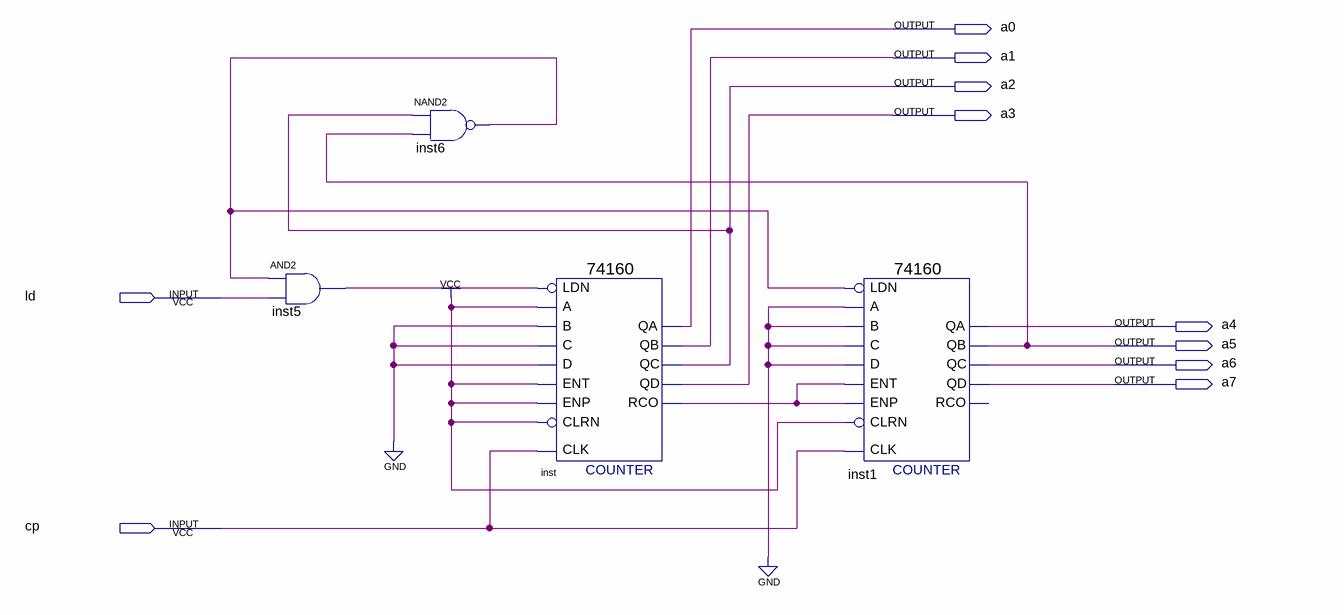
[diagram p0: schematic sheet]
// Quartus schematic jz24.bdf as structural Verilog: 4 symbols, 10 pins
module jz24 (
  input  ld,
  input  cp,
  output a0,
  output a1,
  output a2,
  output a3,
  output a4,
  output a5,
  output a6,
  output a7
);

  wire inst5_out, inst6_out, inst_rco;

  and inst5 (inst5_out, inst6_out, ld);
  nand inst6 (inst6_out, a2, a5);
  \74160  inst (
    .CLK(cp), .ENT(1'b1), .A(1'b1), .B(1'b0), .C(1'b0), .D(1'b0), .LDN(inst5_out), .ENP(1'b1), .CLRN(1'b1),
    .QD(a3), .QA(a0), .QB(a1), .QC(a2), .RCO(inst_rco));
  \74160  inst1 (
    .CLK(cp), .ENT(inst_rco), .A(1'b0), .B(1'b0), .C(1'b0), .D(1'b0), .LDN(inst6_out), .ENP(inst_rco),
    .CLRN(1'b1), .QD(a7), .QA(a4), .QB(a5), .QC(a6));  // open: RCO
endmodule
